# EAGLE design Keg Cop - Sensors (EAGLE 9.5.2)
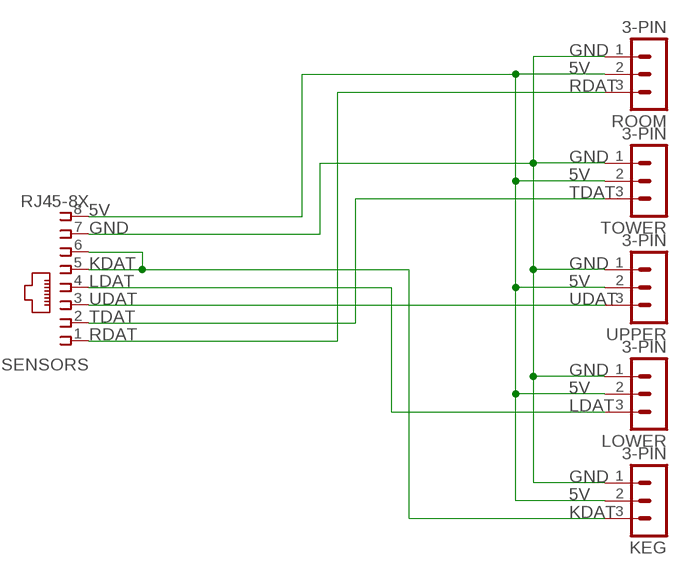
[diagram p0: schematic, sheet 1]

## Parts
KEG  3-PIN  HDR-3  [HDR-3_VERT]
LOWER  3-PIN  HDR-3  [HDR-3_VERT]
ROOM  3-PIN  HDR-3  [HDR-3_VERT]
SENSORS  RJ45-8X  [RJ45-NO-SHIELD]
TOWER  3-PIN  HDR-3  [HDR-3_VERT]
UPPER  3-PIN  HDR-3  [HDR-3_VERT]

## Nets
5V: KEG.2 LOWER.2 ROOM.2 SENSORS.8 TOWER.2 UPPER.2
GND: KEG.1 LOWER.1 ROOM.1 SENSORS.7 TOWER.1 UPPER.1
KDAT: KEG.3 SENSORS.5 SENSORS.6
LDAT: LOWER.3 SENSORS.4
RDAT: ROOM.3 SENSORS.1
TDAT: SENSORS.2 TOWER.3
UDAT: SENSORS.3 UPPER.3

## Library data of the parts
KEG LOWER ROOM TOWER UPPER = Donnie:HDR-3: PIN HEADER
SENSORS = con-tycoelectronics:RJ45: CORCOM Modular RJ Jacks No Shield Source: www.tycoelectronics.com .. ENG_DS_1654001_1099_RJ_L_0507.pdf; MPN: RJ45-8X; OC_FARNELL: unknown; OC_NEWARK: 16R6101

## Board
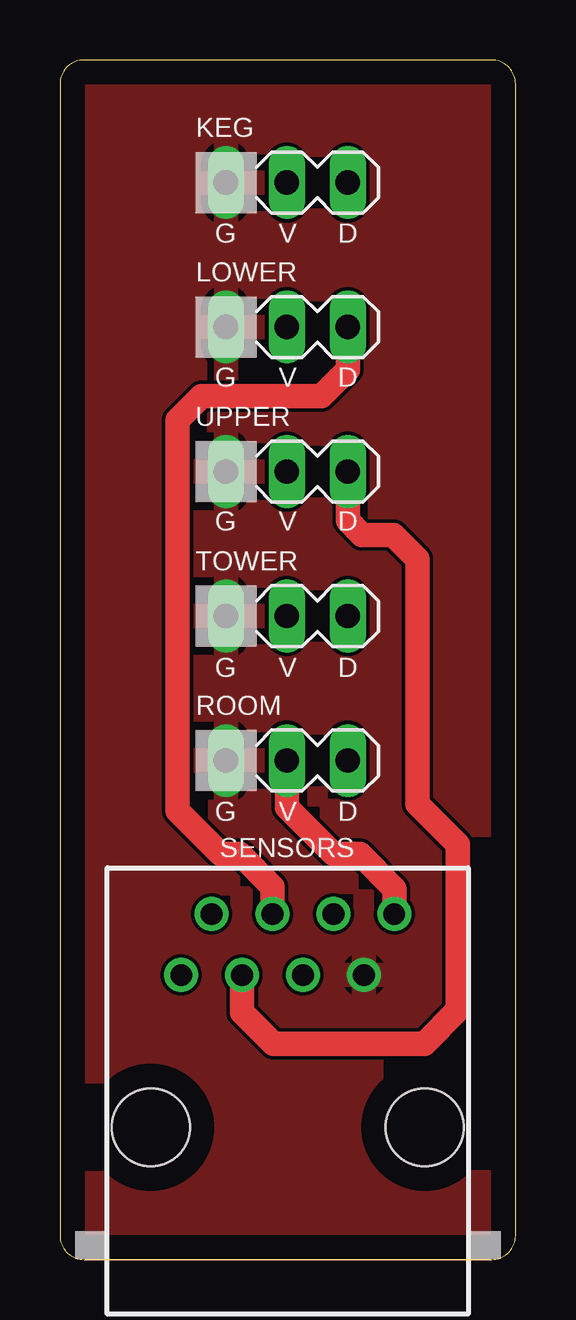
[diagram p1: board, top side]
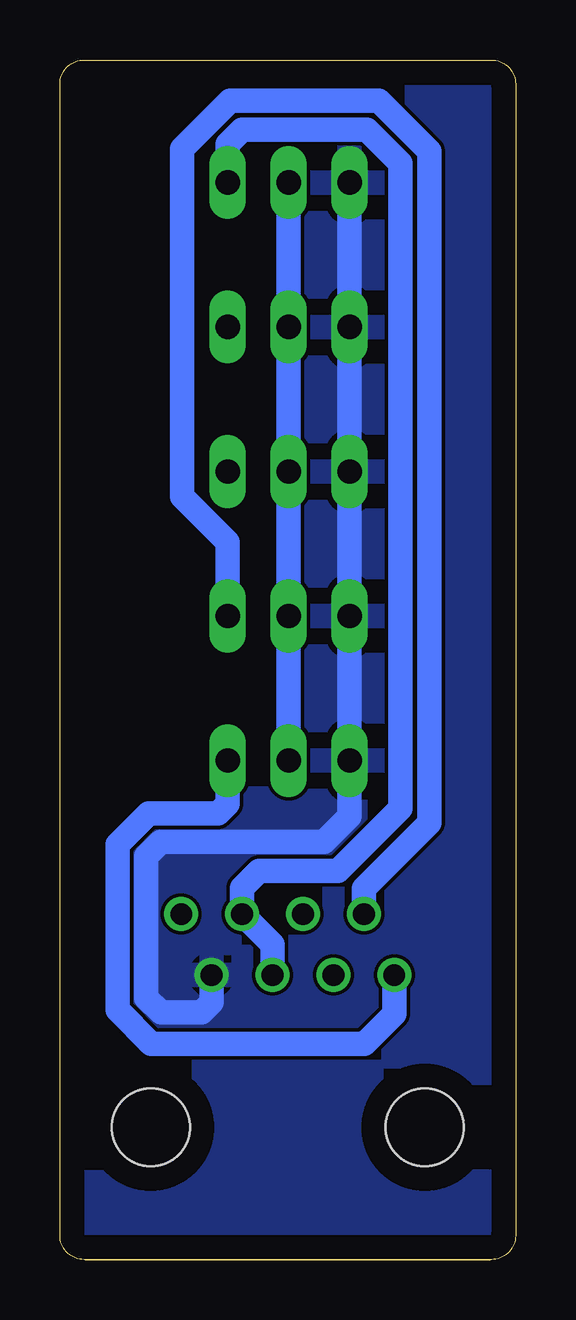
[diagram p2: board, bottom side, seen from below]

Size 19 x 50 mm. Coordinates in mm from the lower left corner, seen from the top.
Outline: 0,49 0,1 arc90 1,0 18,0 arc90 19,1 19,49 arc90 18,50 1,50 arc90 0,49
Copper layers (1*16): Top 0.035mm / dielectric 1.5mm / Bottom 0.035mm
Design rules "default": minimum track width 6mil, minimum drill 0.35mm, track to track 6mil, track to pad 6mil, pad to pad 6mil, via to via 6mil, smd to smd 6mil, copper to edge 40mil, drill to drill 6mil, minimum pad ring 10mil, minimum via ring 8mil, stop-mask expansion 4mil, vias tented up to drill 0mil, thermal gap 10mil

### Footprints (pad centres in the part's own frame; a part is rotated, then mirrored left to right if it is on the bottom)
HDR-3_VERT = drill 1.016 long: 1 0,0; 2 2.54,0; 3 5.08,0
RJ45-NO-SHIELD = drill 0.9 pad 1.4: 1 -4.445,6.35; 2 -3.175,8.89; 3 -1.905,6.35; 4 -0.635,8.89; 5 0.635,6.35; 6 1.905,8.89; 7 3.175,6.35; 8 4.445,8.89 | hole 3.251: -5.715,0; 5.715,0

### Placement (x,y rotation side)
KEG  6.92,44.89 0 top
LOWER  6.92,38.87 0 top
ROOM  6.92,20.8 0 top
SENSORS  9.5,5.51 0 top
TOWER  6.92,26.82 0 top
UPPER  6.92,32.85 0 top

### Tracks (layer width: path | path; a pad name or v marks a point on that pad's centre or on a via)
5V
  Top 1.016: ROOM.2 9.46,18.84 11.4,16.9 12.5,16.9 13.95,15.46 SENSORS.8
  Bottom 1.016: ROOM.2 TOWER.2 UPPER.2 LOWER.2 KEG.2
GND
  Bottom 1.016: KEG.1 LOWER.1 UPPER.1 TOWER.1 ROOM.1 6.92,18.48 8,17.4 14.8,17.4 15.4,16.8 15.4,10.91 14.79,10.3 13.1,10.3 12.68,10.73 SENSORS.7
  pour Top: 20,51 20,-1 -1,-1 -1,51
  pour Bottom: -1,51 20,51 20,-1 -1,-1
KDAT
  Bottom 1.016: KEG.3 12,46.5 11.4,47.1 6.2,47.1 4.8,45.7 4.8,18.8 7.4,16.2 10.7,16.2 11.4,15.5 SENSORS.6 10.13,13.13 SENSORS.5
LDAT
  Top 1.016: LOWER.3 12,37.1 10.9,36 5.9,36 4.9,35 4.9,18.7 6.7,16.9 7.5,16.9 8.87,15.54 SENSORS.4
RDAT
  Bottom 1.016: ROOM.3 12,19 12.4,18.6 15.3,18.6 16.6,17.3 16.6,10.4 15.2,9 6.3,9 5.05,10.25 SENSORS.1
TDAT
  Bottom 1.016: TOWER.3 12,29.9 13.9,31.8 13.9,46.3 11.9,48.3 5.7,48.3 3.6,46.2 3.6,18.2 6.33,15.48 SENSORS.2
UDAT
  Top 1.016: UPPER.3 12,30.8 12.6,30.2 13.9,30.2 14.9,29.2 14.9,19 16.6,17.3 16.6,10.4 15.2,9 8.9,9 7.59,10.31 SENSORS.3

### Text on the board
tNames: G | V | D | G | V | D | G | V | D | G | V | D | G | V | D